# EAGLE design source_eagle (EAGLE 9.6.2)
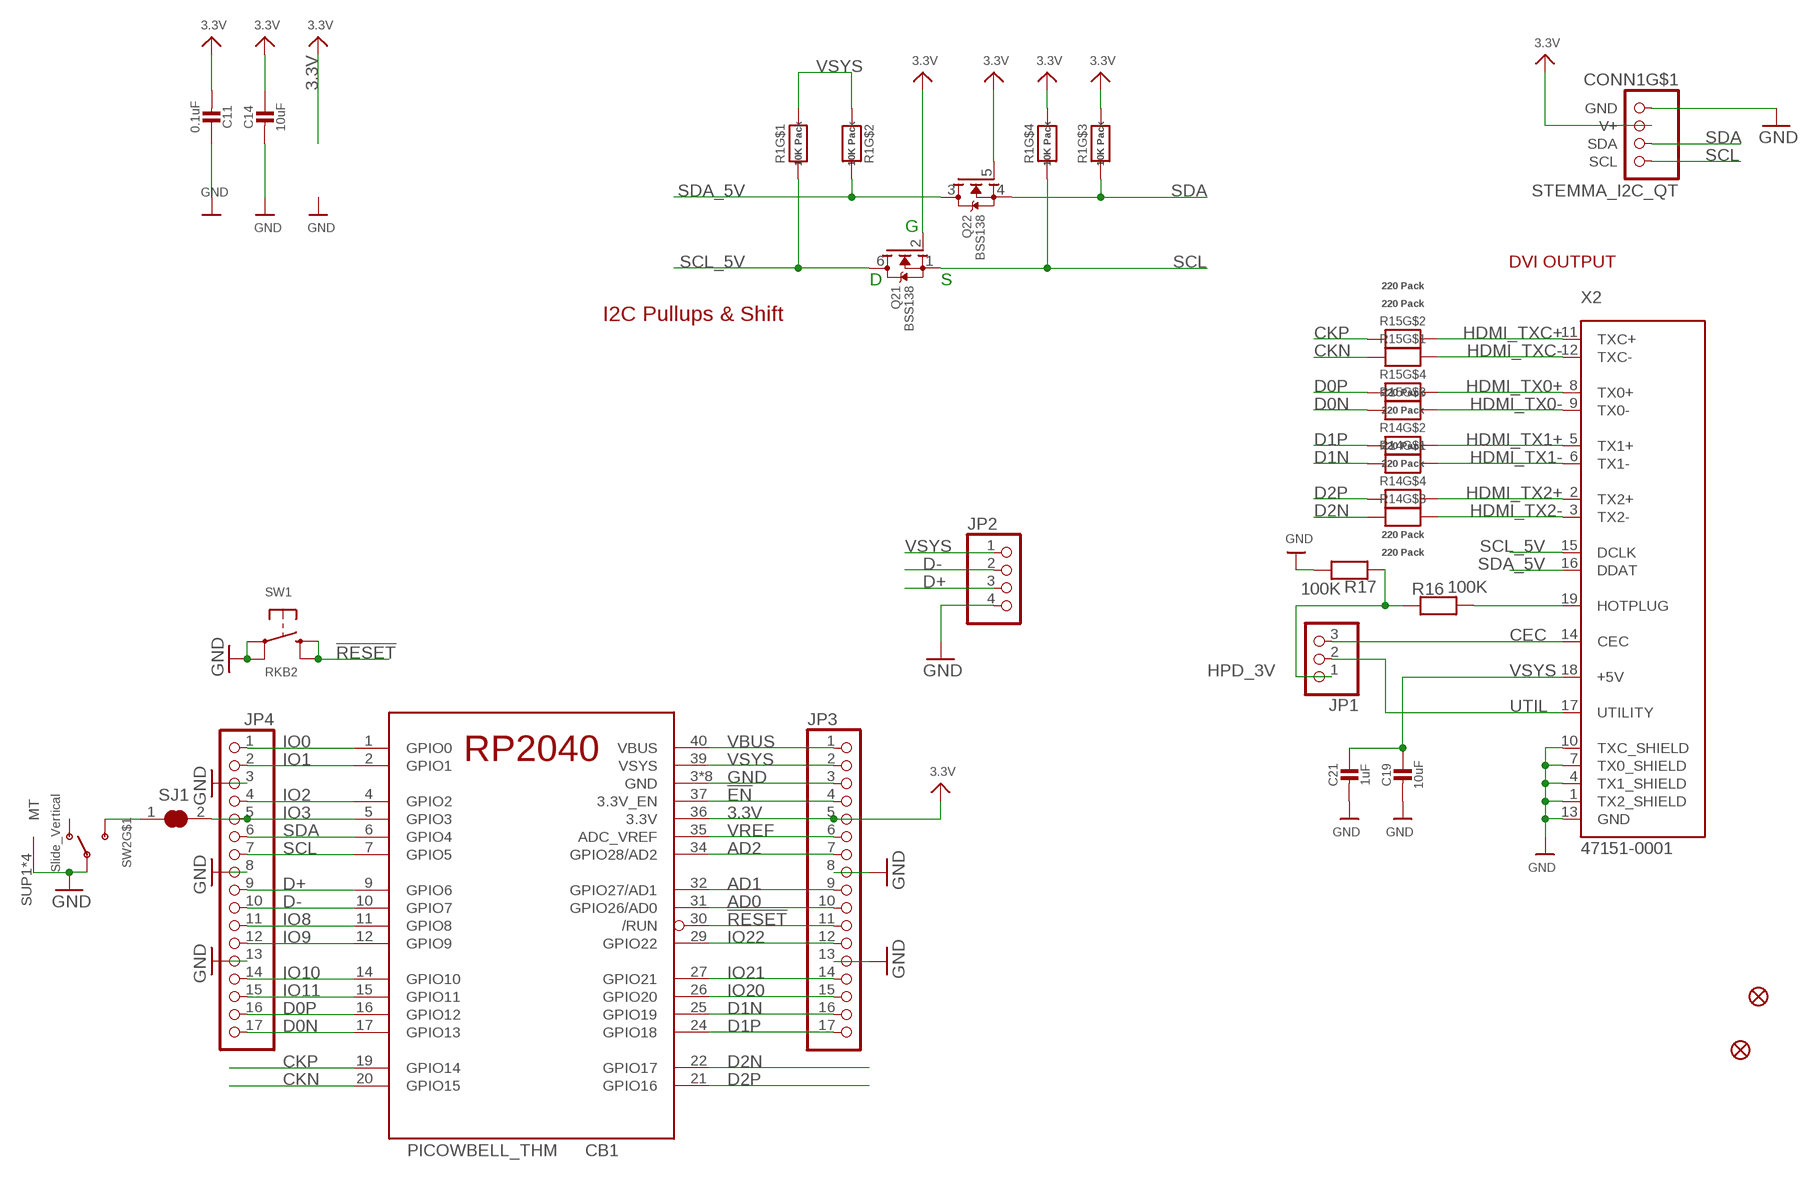
[diagram p0: schematic, sheet 1]

## Parts
C11  0.1uF  CAP_CERAMIC0603_NO  [0603-NO]
C14  10uF  CAP_CERAMIC0805-NOOUTLINE  [0805-NO]
C19  10uF  CAP_CERAMIC0805-NOOUTLINE  [0805-NO]
C21  1uF  CAP_CERAMIC0603_NO  [0603-NO]
CB1  PICOWBELL_THM  [PICOWBELL_THM]
CONN1  STEMMA_I2C_QT  [JST_SH4]
FID1  FIDUCIAL_1MM  [FIDUCIAL_1MM]
FID2  FIDUCIAL_1MM  [FIDUCIAL_1MM]
JP1  HEADER-1X3ROUND  [1X03_ROUND]
JP2  HEADER-1X4ROUND  [1X04_ROUND]
JP3  HEADER-1X17  [1X17_ROUND70]
JP4  HEADER-1X17  [1X17_ROUND70]
Q2  BSS138  MOSFET-N_DUAL  [SOT363]
R1  10K Pack  RESISTOR_4PACK  [RESPACK_4X0603]
R14  220 Pack  RESISTOR_4PACK  [RESPACK_4X0603]
R15  220 Pack  RESISTOR_4PACK  [RESPACK_4X0603]
R16  100K  RESISTOR_0603_NOOUT  [0603-NO]
R17  100K  RESISTOR_0603_NOOUT  [0603-NO]
SJ1  SOLDERJUMPER_CLOSED  [SOLDERJUMPER_CLOSEDWIRE]
SW1  RKB2  SWITCH_TACT_SMT_RKB2  [BTN_RKB2_4.6X2.8]
SW2  Slide_Vertical  SWITCH_SPDT  [SPDT_SMT_SSSS811101]
X2  47151-0001  HDMI_MOLEX_47151_MINI  [MINIHDMI_CNCTECH]

## Nets
3.3V: C11.2 C14.1 CB1.36(3.3V) CONN1.2(V+) JP3.5 Q2.2(1:G) Q2.5(2:G) R1.5 R1.6
!EN: CB1.37(3.3V_EN) JP3.4
!RESET: CB1.30(/RUN) JP3.11 SW1.B'(S1) SW1.B(S)
AD0: CB1.31(GPIO26/AD0) JP3.10
AD1: CB1.32(GPIO27/AD1) JP3.9
AD2: CB1.34(GPIO28/AD2) JP3.7
CEC: JP1.3 X2.14(CEC)
CKN: CB1.20(GPIO15) R15.8
CKP: CB1.19(GPIO14) R15.7
D0N: CB1.17(GPIO13) JP4.17 R15.6
D0P: CB1.16(GPIO12) JP4.16 R15.5
D1N: CB1.25(GPIO19) JP3.16 R14.8
D1P: CB1.24(GPIO18) JP3.17 R14.7
D2N: CB1.22(GPIO17) R14.6
D2P: CB1.21(GPIO16) R14.5
D+: CB1.9(GPIO6) JP2.3 JP4.9
D-: CB1.10(GPIO7) JP2.2 JP4.10
GND: C11.1 C14.2 C19.2 C21.2 CB1.3(GND) CB1.8(GND) CB1.13(GND) CB1.18(GND) CB1.23(GND) CB1.28(GND) CB1.33(GND) CB1.38(GND) CONN1.1(GND) JP2.4 JP3.3 JP3.8 JP3.13 JP4.3 JP4.8 JP4.13 R17.2 SW1.A'(P1) SW1.A(P) SW2.B(P) SW2.SUP1(MT) SW2.SUP2(MT) SW2.SUP3(MT) SW2.SUP4(MT) X2.1(TX2_SHIELD) X2.4(TX1_SHIELD) X2.7(TX0_SHIELD) X2.10(TXC_SHIELD) X2.13(GND)
HDMI_TX0+: R15.4 X2.8(TX0+)
HDMI_TX0-: R15.3 X2.9(TX0-)
HDMI_TX1+: R14.2 X2.5(TX1+)
HDMI_TX1-: R14.1 X2.6(TX1-)
HDMI_TX2+: R14.4 X2.2(TX2+)
HDMI_TX2-: R14.3 X2.3(TX2-)
HDMI_TXC+: R15.2 X2.11(TXC+)
HDMI_TXC-: R15.1 X2.12(TXC-)
HPD: R16.2 X2.19(HOTPLUG)
HPD_3V: JP1.1 R16.1 R17.1
IO0: CB1.1(GPIO0) JP4.1
IO1: CB1.2(GPIO1) JP4.2
IO2: CB1.4(GPIO2) JP4.4
IO3: CB1.5(GPIO3) JP4.5 SJ1.2
IO8: CB1.11(GPIO8) JP4.11
IO9: CB1.12(GPIO9) JP4.12
IO10: CB1.14(GPIO10) JP4.14
IO11: CB1.15(GPIO11) JP4.15
IO20: CB1.26(GPIO20) JP3.15
IO21: CB1.27(GPIO21) JP3.14
IO22: CB1.29(GPIO22) JP3.12
N$1: SJ1.1 SW2.C(S)
SCL: CB1.7(GPIO5) CONN1.4(SCL) JP4.7 Q2.1(1:S) R1.4
SCL_5V: Q2.6(1:D) R1.8 X2.15(DCLK)
SDA: CB1.6(GPIO4) CONN1.3(SDA) JP4.6 Q2.4(2:S) R1.3
SDA_5V: Q2.3(2:D) R1.7 X2.16(DDAT)
UTIL: JP1.2 X2.17(UTILITY)
VBUS: CB1.40(VBUS) JP3.1
VREF: CB1.35(ADC_VREF) JP3.6
VSYS: C19.1 C21.1 CB1.39(VSYS) JP2.1 JP3.2 R1.1 R1.2 X2.18(+5V)
Unconnected: CONN1.MT1(MT) CONN1.MT2(MT) SW2.A(O)

## Notes on the sheet
- G
- DVI OUTPUT
- D | S
- I2C Pullups & Shift

## Power pins joined to a net without a drawn wire
GND: X2.MNT1(GND) X2.MNT2(GND) X2.MNT3(GND) X2.MNT4(GND)

## Library data of the parts
C11 C14 C21 = microbuilder:CAP_CERAMIC: Ceramic Capacitors For new designs, use the packages preceded by an '_' character since they are more reliable: The following footprints should be used on most boards: _0402 - Standard footprint for regular board layouts _0603 - Standard footprint for regular board layouts _0805 - Standard footprint for regular board layouts _1206 - Standard footprint for regular board layouts For extremely tight-pitch boards where space is at a premium, the following 'micro-pitch' footprints can be used (smaller pads, no silkscreen outline, etc.): _0402MP - Micro-pitch footprint for very dense/compact boards _0603MP - Micro-pitch footprint for very dense/compact boards _0805MP - Micro-pitch footprint for very dense/compact boards _1206MP - Micro-pitch footprint for very dense/compact boards
C19 = microbuilder:CAP_CERAMIC: Ceramic Capacitors For new designs, use the packages preceded by an '_' character since they are more reliable: The following footprints should be used on most boards: _0402 - Standard footprint for regular board layouts _0603 - Standard footprint for regular board layouts _0805 - Standard footprint for regular board layouts _1206 - Standard footprint for regular board layouts For extremely tight-pitch boards where space is at a premium, the following 'micro-pitch' footprints can be used (smaller pads, no silkscreen outline, etc.): _0402MP - Micro-pitch footprint for very dense/compact boards _0603MP - Micro-pitch footprint for very dense/compact boards _0805MP - Micro-pitch footprint for very dense/compact boards _1206MP - Micro-pitch footprint for very dense/compact boards; REV: A
CB1 = adafruit_micro:PICOWBELL
CONN1 = adafruit_electromech:STEMMA_I2C; LCSC: C2845363
FID1 FID2 = microbuilder:FIDUCIAL: Fiducial Alignment Points Various fiducial points for machine vision alignment.; BOM: EXCLUDE
JP1 = microbuilder:HEADER-1X3: PIN HEADER
JP2 = microbuilder:HEADER-1X4: PIN HEADER
JP3 JP4 = microbuilder:HEADER-1X17: Header 1x17
Q2 = microbuilder:MOSFET-N_DUAL: Dual N-Channel MOSFET SOT363 (2.0x1.25mm) 2N7002PS - 60V, 320mA [Digikey: 568-5984-1-ND]; JLC_ROTATION: 270
R1 R14 R15 = microbuilder:RESISTOR_4PACK: Resistor Packs (4 resistors) 4 x 0603 10K 1/16W - Digikey: YC164J-10KCT-ND
R16 R17 = microbuilder:RESISTOR: Resistors For new designs, use the packages preceded by an '_' character since they are more reliable: The following footprints should be used on most boards: _0402 - Standard footprint for regular board layouts _0603 - Standard footprint for regular board layouts _0805 - Standard footprint for regular board layouts _1206 - Standard footprint for regular board layouts For extremely tight-pitch boards where space is at a premium, the following 'micro-pitch' footprints can be used (smaller pads, no silkscreen outline, etc.): _0402MP - Micro-pitch footprint for very dense/compact boards _0603MP - Micro-pitch footprint for very dense/compact boards _0805MP - Micro-pitch footprint for very dense/compact boards _1206MP - Micro-pitch footprint for very dense/compact boards
SJ1 = microbuilder:SOLDERJUMPER_CLOSED: Solder Jumper - Closed These solder jumpers are closed by default CLOSEDWIRE - 10 mil trace between pads that can be cut and resoldered later CLOSEDPERM - 63 mil trace between pads for a permanent connection (used to 'bridge' two signals, a shameless hack for Eagle). Can double as a test point as well (no cream layer)
SW1 = adafruit_electromech:SWITCH_TACT_SMT: SMT Tact Switches RKB2 https://www.digikey.com/short/m027prz5
SW2 = adafruit_electromech:SWITCH_SPDT: Switch - SPDT SSSS811101 - Horizontal Two Position SMT, 0.3A 4V [Mouser: 688-SSSS811101]
X2 = adafruit_electromech:HDMI_MOLEX_47151: The default footprint uses layer 46 (Milling) for the tabs, the DIMLAYER footprint uses layer 20 (Dimensions). Both will probably require special instructions to the board house

## Net classes
1 highpower: width 0.305 mm, drill 0.381 mm

## Board
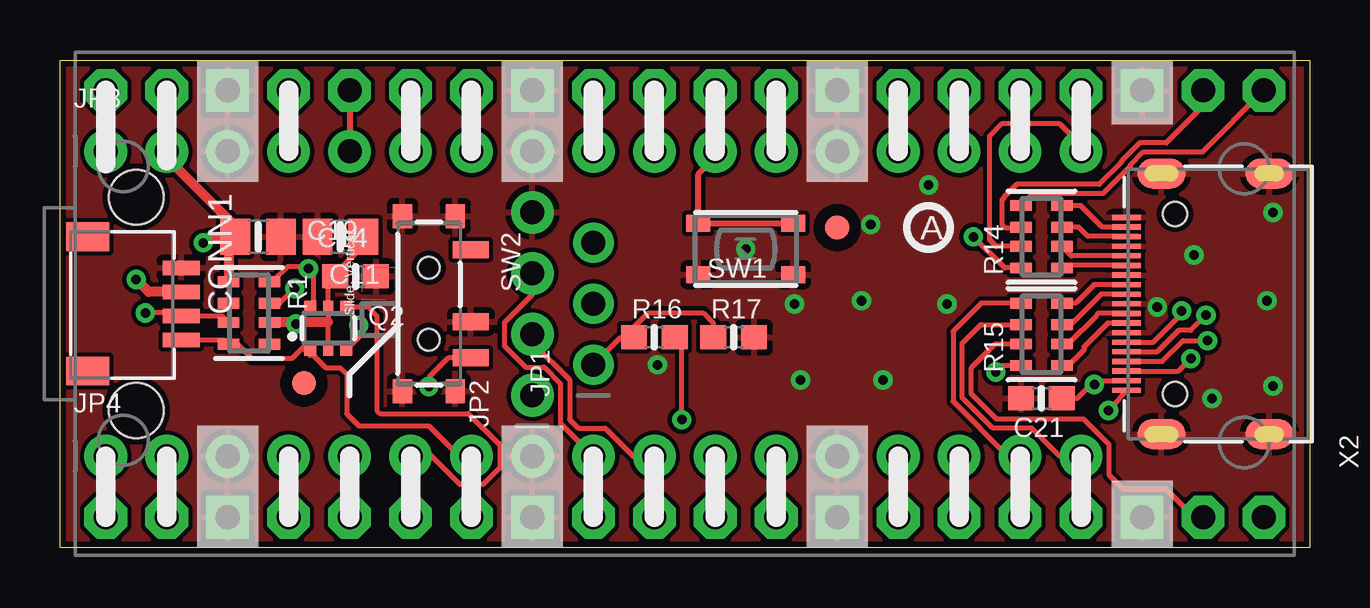
[diagram p1: board, top side]
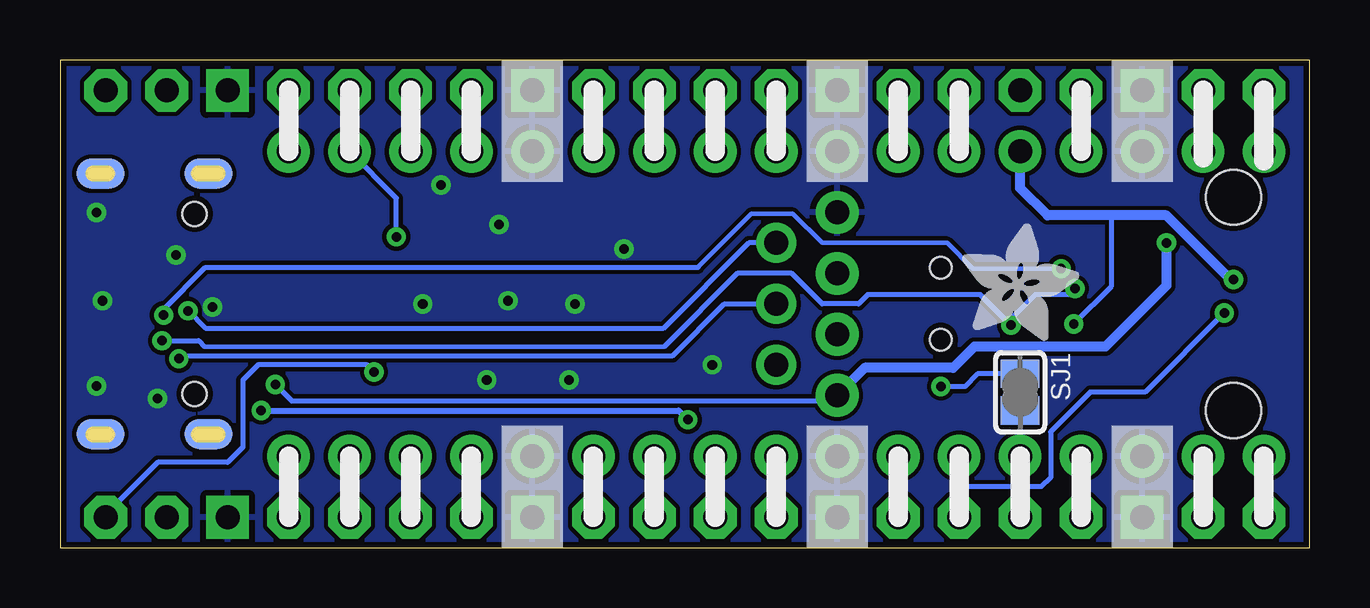
[diagram p2: board, bottom side, seen from below]

Size 52.07 x 20.32 mm. Coordinates in mm from the lower left corner, seen from the top.
Outline: 0,0 0,20.32 52.07,20.32 52.07,0 0,0
Copper layers (1*16): Top 0.035mm / dielectric 1.5mm / Bottom 0.035mm
Design rules "adafruit 7-7": minimum track width 7mil, minimum drill 15.5mil, track to track 7mil, track to pad 7mil, pad to pad 7mil, via to via 7mil, smd to smd 7mil, copper to edge 10mil, drill to drill 8mil, minimum pad ring 7mil, minimum via ring 8mil, stop-mask expansion 2mil, vias tented up to drill 20mil, thermal gap 10mil
Holes 2.29 mm at 3.17,14.61 3.17,5.71

### Footprints (pad centres in the part's own frame; a part is rotated, then mirrored left to right if it is on the bottom)
0603-NO = smd 1.075 x 1: 1 -0.85,0; 2 0.85,0
0805-NO = smd 1.24 x 1.5: 1 -0.95,0; 2 0.95,0
PICOWBELL_THM = drill 1 pad 1.778 octagon: 1 -24.13,-8.89; 2 -21.59,-8.89; 4 -16.51,-8.89; 5 -13.97,-8.89; 6 -11.43,-8.89; 7 -8.89,-8.89; 9 -3.81,-8.89; 10 -1.27,-8.89; 11 1.27,-8.89; 12 3.81,-8.89; 14 8.89,-8.89; 15 11.43,-8.89; 16 13.97,-8.89; 17 16.51,-8.89; 19 21.59,-8.89; 20 24.13,-8.89; 21 24.13,8.89; 22 21.59,8.89; 24 16.51,8.89; 25 13.97,8.89; 26 11.43,8.89; 27 8.89,8.89; 29 3.81,8.89; 30 1.27,8.89; 31 -1.27,8.89; 32 -3.81,8.89; 34 -8.89,8.89; 35 -11.43,8.89; 36 -13.97,8.89; 37 -16.51,8.89; 39 -21.59,8.89; 40 -24.13,8.89 | drill 1 pad 1.778 square: 3 -19.05,-8.89; 8 -6.35,-8.89; 13 6.35,-8.89; 18 19.05,-8.89; 23 19.05,8.89; 28 6.35,8.89; 33 -6.35,8.89; 38 -19.05,8.89
JST_SH4 = smd 0.6 x 1.55: 1 -1.5,2.006; 2 -0.5,2.006; 3 0.5,2.006; 4 1.5,2.006 | smd 1.2 x 1.8: MT1 -2.8,-1.894; MT2 2.8,-1.894
FIDUCIAL_1MM = smd 1 x 1: 1 0,0
1X03_ROUND = drill 1 pad 1.676: 1 -2.54,0; 2 0,0; 3 2.54,0
1X04_ROUND = drill 1 pad 1.778: 1 -3.81,0; 2 -1.27,0; 3 1.27,0; 4 3.81,0
1X17_ROUND70 = drill 1 pad 1.778: 1 -20.32,0; 2 -17.78,0; 3 -15.24,0; 4 -12.7,0; 5 -10.16,0; 6 -7.62,0; 7 -5.08,0; 8 -2.54,0; 9 0,0; 10 2.54,0; 11 5.08,0; 12 7.62,0; 13 10.16,0; 14 12.7,0; 15 15.24,0; 16 17.78,0; 17 20.32,0
SOT363 = smd 0.5 x 0.5: 1 -0.75,-0.9; 3 0.75,-0.9; 4 0.75,0.9; 6 -0.75,0.9 | smd 0.4 x 0.5: 2 0,-0.9; 5 0,0.9
RESPACK_4X0603 = smd 0.45 x 0.9: 1 -1.3,-0.85; 2 -0.4,-0.85; 3 0.4,-0.85; 4 1.3,-0.85; 5 1.3,0.85; 6 0.4,0.85; 7 -0.4,0.85; 8 -1.3,0.85
SOLDERJUMPER_CLOSEDWIRE = smd 1.168 x 1.6: 1 -0.762,0; 2 0.762,0 | smd 0.635 x 0.203: WIRE 0,0
BTN_RKB2_4.6X2.8 = smd 1 x 0.7: A 1.973,1.075; A' -1.973,1.075; B 1.973,-1.075; B' -1.973,-1.075
SPDT_SMT_SSSS811101 = smd 0.7 x 1.5: A -2.25,1.242; B 0.75,1.242; C 2.25,1.242 | smd 1 x 0.8: SUP1 -3.65,0.592; SUP2 -3.65,-1.608; SUP3 3.65,0.592; SUP4 3.65,-1.608 | hole 0.9: -1.5,-0.508; 1.5,-0.508
MINIHDMI_CNCTECH = smd 0.22 x 1.194: 1 3.6,3.066; 2 3.2,3.066; 3 2.8,3.066; 4 2.4,3.066; 5 2,3.066; 6 1.6,3.066; 7 1.2,3.066; 8 0.8,3.066; 9 0.4,3.066; 10 0,3.066; 11 -0.4,3.066; 12 -0.8,3.066; 13 -1.2,3.066; 14 -1.6,3.066; 15 -2,3.066; 16 -2.4,3.066; 17 -2.8,3.066; 18 -3.2,3.066; 19 -3.6,3.066 | smd 1.25 x 2: MNT1 5.425,1.606; MNT2 5.425,-2.894; MNT3 -5.425,-2.894; MNT4 -5.425,1.606 | smd 1.25 x 2 bottom: MNT5 5.425,1.606; MNT6 5.425,-2.894; MNT7 -5.425,-2.894; MNT8 -5.425,1.606 | hole 1: -3.75,1.038; 3.75,1.038

### Placement (x,y rotation side)
C11  12.32,11.3 180 top
C14  11.68,12.95 180 top
C19  8.26,12.95 0 top
C21  40.89,6.22 180 top
CB1  26.04,10.16 0 top
CONN1  3.05,10.16 270 top
FID1  10.16,6.86 0 top
FID2  32.38,13.33 0 top
JP1  22.23,10.16 90 top
JP2  19.68,10.16 90 top
JP3  22.23,16.51 0 top
JP4  22.23,3.81 0 top
PLABEL109  [PLABEL109]  4.7,10.1 90 bottom
PLABEL110  [PLABEL110]  6.73,6.98 0 top
PLABEL111  [PLABEL111]  23.37,7.24 0 top
PLABEL112  [PLABEL112]  23.5,10.16 0 top
PLABEL113  [PLABEL113]  23.5,12.57 0 top
PLABEL114  [PLABEL114]  1.14,14.61 90 top
PLABEL115  [PLABEL115]  5.08,14.61 90 top
PLABEL116  [PLABEL116]  12.06,14.99 0 top
PLABEL117  [PLABEL117]  27.3,14.99 0 top
PLABEL118  [PLABEL118]  50.16,17.4 0 top
PLABEL119  [PLABEL119]  47.62,17.4 0 top
PLABEL120  [PLABEL120]  29.84,14.99 0 top
PLABEL121  [PLABEL121]  37.47,14.99 0 top
PLABEL122  [PLABEL122]  44.45,16.51 0 top
PLABEL123  [PLABEL123]  37.21,5.33 0 top
PLABEL124  [PLABEL124]  34.92,14.99 0 top
PLABEL125  [PLABEL125]  39.62,5.33 0 top
PLABEL126  [PLABEL126]  24.77,14.99 0 top
PLABEL127  [PLABEL127]  17.14,14.99 0 top
PLABEL128  [PLABEL128]  14.61,14.99 0 top
PLABEL129  [PLABEL129]  17.14,5.46 0 top
PLABEL130  [PLABEL130]  14.22,5.46 0 top
PLABEL131  [PLABEL131]  12.06,5.46 0 top
PLABEL132  [PLABEL132]  9.53,5.46 0 top
PLABEL133  [PLABEL133]  4.95,5.46 0 top
PLABEL134  [PLABEL134]  1.4,5.46 0 top
PLABEL135  [PLABEL135]  43.18,5.33 0 top
PLABEL136  [PLABEL136]  47.62,2.92 0 top
PLABEL137  [PLABEL137]  50.16,2.92 0 top
PLABEL138  [PLABEL138]  22.23,5.33 0 top
PLABEL139  [PLABEL139]  9.53,14.99 0 top
PLABEL140  [PLABEL140]  22.23,14.99 0 top
PLABEL141  [PLABEL141]  34.92,5.33 0 top
PLABEL142  [PLABEL142]  29.84,5.33 0 top
PLABEL143  [PLABEL143]  27.3,5.33 0 top
PLABEL144  [PLABEL144]  24.77,5.33 0 top
PLABEL145  [PLABEL145]  31.11,6.48 0 top
PLABEL146  [PLABEL146]  28.32,10.16 0 top
PLABEL147  [PLABEL147]  17.27,13.72 0 top
PLABEL148  [PLABEL148]  17.65,9.91 90 top
PLABEL149  [PLABEL149]  21.21,9.27 270 top
PLABEL150  [PLABEL150]  17.02,6.86 0 top
PLABEL151  [PLABEL151]  41.4,15.49 0 top
PLABEL152  [PLABEL152]  8.76,7.37 0 bottom
PLABEL154  [PLABEL154]  44.7,10.03 0 bottom
PLABEL155  [PLABEL155]  50.16,2.92 0 bottom
PLABEL156  [PLABEL156]  47.62,2.92 0 bottom
PLABEL157  [PLABEL157]  45.09,2.92 0 bottom
PLABEL158  [PLABEL158]  42.55,5.46 0 bottom
PLABEL159  [PLABEL159]  40.01,5.46 0 bottom
PLABEL160  [PLABEL160]  37.47,5.46 0 bottom
PLABEL161  [PLABEL161]  34.92,5.46 0 bottom
PLABEL162  [PLABEL162]  29.84,5.46 0 bottom
PLABEL163  [PLABEL163]  27.3,5.46 0 bottom
PLABEL164  [PLABEL164]  24.77,5.46 0 bottom
PLABEL165  [PLABEL165]  22.23,5.46 0 bottom
PLABEL166  [PLABEL166]  17.14,5.46 0 bottom
PLABEL167  [PLABEL167]  14.61,5.46 0 bottom
PLABEL168  [PLABEL168]  9.53,5.46 0 bottom
PLABEL169  [PLABEL169]  4.95,5.46 0 bottom
PLABEL170  [PLABEL170]  1.14,5.46 0 bottom
PLABEL171  [PLABEL171]  16.89,13.21 0 bottom
PLABEL172  [PLABEL172]  17.4,11.3 0 bottom
PLABEL173  [PLABEL173]  17.65,9.02 0 bottom
PLABEL174  [PLABEL174]  17.65,6.98 0 bottom
PLABEL175  [PLABEL175]  9.53,14.86 0 bottom
PLABEL176  [PLABEL176]  12.06,14.86 0 bottom
PLABEL177  [PLABEL177]  14.61,14.86 0 bottom
PLABEL178  [PLABEL178]  17.14,14.86 0 bottom
PLABEL179  [PLABEL179]  22.23,14.86 0 bottom
PLABEL180  [PLABEL180]  24.77,14.86 0 bottom
PLABEL181  [PLABEL181]  27.3,14.86 0 bottom
PLABEL182  [PLABEL182]  29.84,14.86 0 bottom
PLABEL183  [PLABEL183]  42.55,14.86 0 bottom
PLABEL184  [PLABEL184]  40.01,14.86 0 bottom
PLABEL185  [PLABEL185]  45.09,17.4 0 bottom
PLABEL186  [PLABEL186]  47.62,17.4 0 bottom
PLABEL187  [PLABEL187]  50.16,17.4 0 bottom
PLABEL188  [PLABEL188]  37.47,14.86 0 bottom
PLABEL189  [PLABEL189]  34.92,14.86 0 bottom
PLABEL190  [PLABEL190]  4.95,14.61 90 bottom
PLABEL191  [PLABEL191]  0.89,14.86 90 bottom
PLABEL192  [PLABEL192]  48.9,10.16 90 bottom
PLABEL193  [PLABEL193]  31.5,9.02 0 bottom
Q2  11.18,9.14 0 top
R1  7.87,9.78 270 top
R14  40.89,12.95 90 top
R15  40.89,8.89 90 top
R16  24.77,8.76 0 top
R17  28.07,8.76 0 top
SJ1  12.06,6.48 270 bottom
SW1  28.57,12.45 180 top
SW2  15.88,10.16 270 top
U$1  [ADAFRUIT_5MM]  14.48,8.64 0 bottom
U$10  [PCBFEAT-REV-040]  36.2,13.33 0 top
X2  47.5,10.16 90 top

### Tracks (layer width: path | path; a pad name or v marks a point on that pad's centre or on a via)
3.3V  (via drill 0.39)
  Top 0.203: C14.1 12.63,12.57 11.36,11.3 | R1.6 R1.5 | C11.2 11.36,11.3 | 11.36,11.3 11.18,11.12 Q2.5 11.18,9.4 Q2.2 | 10.16,9.4 10.08,9.32 v9.83,9.32
  Top 0.254: CB1.36 JP3.5
  Top 0.406: CONN1.2 3.69,10.66 v3.17,11.18 | 11.18,9.4 10.16,9.4 8.74,9.4 R1.6
  Bottom 0.203: v9.83,9.32 8.26,10.9 8.26,13.84
  Bottom 0.406: v3.17,11.18 3.3,11.18 5.97,13.84 8.26,13.84 10.92,13.84 12.06,14.99 JP3.5
!EN
  Bottom 0.406: CB1.37 JP3.4
!RESET
  Top 0.254: SW1.B' SW1.B 26.6,15.55 27.3,16.26 JP3.11
  Bottom 0.406: JP3.11 CB1.30
AD0
  Bottom 0.406: CB1.31 JP3.10
AD1
  Bottom 0.406: CB1.32 JP3.9
AD2
  Bottom 0.406: CB1.34 JP3.7
CEC  (via drill 0.39)
  Top 0.203: v46.74,9.87 46.74,9.74 45.55,8.56 X2.14
  Bottom 0.203: v46.74,9.87 46.01,9.14 26.92,9.14 23.37,12.7 JP1.3
CKN  (via drill 0.39)
  Top 0.203: R15.8 39.26,7.59 v38.99,7.32
  Bottom 0.203: v38.99,7.32 39.29,7.62 43.81,7.62 44.45,6.98 44.45,4.19 45.09,3.56 48.01,3.56 50.24,1.33 CB1.20
CKP
  Top 0.203: CB1.19 47.46,1.06 46.09,2.44 44.3,2.44 43.71,3.02 43.71,4.29 42.65,5.36 39.02,5.36 37.97,6.41 37.97,7.49 38.97,8.49 R15.7
D0N
  Top 0.203: JP4.17 41.66,3.81 40.49,4.98 38.87,4.98 37.59,6.25 37.59,8.51 38.37,9.29 R15.6
  Bottom 0.406: JP4.17 CB1.17
D0P
  Top 0.203: R15.5 38.38,10.19 37.21,9.02 37.21,6.1 39.5,3.81 JP4.16
  Bottom 0.406: CB1.16 JP4.16
D1N  (via drill 0.39)
  Top 0.203: R14.8 39.36,11.65 v38.06,12.95
  Bottom 0.203: v38.06,12.95 38.06,14.56 JP3.16
  Bottom 0.406: JP3.16 CB1.25
D1P
  Top 0.203: R14.7 39.01,12.55 38.73,12.83 38.73,17.14 39.27,17.68 41.63,17.68 42.55,16.76 JP3.17
  Bottom 0.406: CB1.24 JP3.17
D2N
  Top 0.203: CB1.22 47.62,18.52 47.68,18.45 46.1,16.87 44.98,16.87 44.23,16.12 44.23,16.07 43.3,15.14 39.86,15.14 39.31,14.59 39.31,14.55 39.24,14.48 39.24,13.46 39.37,13.33 40.02,13.33 R14.6
D2P
  Top 0.203: R14.5 40.55,14.76 43.46,14.76 44.61,15.91 44.61,15.96 45.14,16.49 47.6,16.49 CB1.21
D+
  Top 0.203: JP2.3 19.68,10.54 18.52,9.37 18.52,8.41 19.4,7.52 20.17,7.52 20.85,6.83 20.85,5.18 JP4.9
  Bottom 0.406: CB1.9 JP4.9
D-
  Top 0.203: JP2.2 19.68,8.54 21.23,6.99 21.23,5.34 21.59,4.98 22.71,4.98 23.88,3.81 JP4.10
  Bottom 0.406: JP4.10 CB1.10
GND  (via drill 0.4)
  other vias: 47.24,12.19 48.01,6.22 50.55,6.73 50.55,13.97 50.29,10.29 36.2,15.11 33.78,13.46 28.57,12.45 30.61,10.16 30.86,6.98 34.29,6.98 24.89,7.62 33.4,10.29 36.96,10.16 45.72,10.03
  pour Top: 0,20.32 52.07,20.32 52.07,0 0,0
  pour Bottom: 0,20.32 52.07,20.32 52.07,0 0,0
HDMI_TX0+
  Top 0.203: X2.8 43.09,10.96 42.32,10.19 R15.4
HDMI_TX0-
  Top 0.203: X2.9 43.38,10.56 42.11,9.29 R15.3
HDMI_TX1+
  Top 0.203: R14.2 42.14,12.16 X2.5
HDMI_TX1-
  Top 0.203: X2.6 41.85,11.76 R14.1
HDMI_TX2+
  Top 0.203: X2.2 43.44,13.36 42.54,14.25 R14.4
HDMI_TX2-
  Top 0.203: X2.3 44.93,12.97 42.83,12.97 42.45,13.35 R14.3
HDMI_TXC+
  Top 0.203: X2.11 43.23,9.76 43.18,9.65 42.01,8.49 R15.2
HDMI_TXC-
  Top 0.203: X2.12 43.65,9.36 42.67,8.38 42.67,8.26 42.01,7.59 R15.1
HPD  (via drill 0.39)
  Top 0.203: X2.19 43.82,5.85 v43.69,5.71 | v25.91,5.33 25.91,9.06 R16.2
  Bottom 0.254: v43.69,5.71 26.29,5.71 v25.91,5.33
HPD_3V
  Top 0.203: JP1.1 23.37,8.76 R16.1 23.91,9.18 24.51,9.78 26.8,9.78 27.22,9.36 R17.1
IO0
  Bottom 0.406: JP4.1 CB1.1
IO1
  Bottom 0.406: CB1.2 JP4.2
IO2
  Bottom 0.406: JP4.4 CB1.4
IO3
  Top 0.305: JP4.5 CB1.5
  Bottom 0.203: SJ1.2 JP4.5
IO8
  Bottom 0.406: CB1.11 JP4.11
IO9
  Bottom 0.406: JP4.12 CB1.12
IO10
  Bottom 0.406: CB1.14 JP4.14
IO11
  Bottom 0.406: JP4.15 CB1.15
IO20
  Bottom 0.406: CB1.26 JP3.15
IO21
  Bottom 0.406: JP3.14 CB1.27
IO22
  Bottom 0.406: CB1.29 JP3.12
N$1  (via drill 0.39)
  Top 0.203: SW2.C 16.18,7.91 15.37,7.09 v15.37,6.71
  Bottom 0.203: SJ1.1 13.84,7.24 14.37,6.71 v15.37,6.71
SCL
  Top 0.203: CONN1.4 6.84,8.66 R1.4 7.4,8.48 8,7.87 9.65,7.87 10.11,8.33 10.43,8.01 10.43,8.14 | Q2.1 10.43,8.14 | 10.43,8.14 11.07,7.49 11.68,7.49 11.94,7.24 11.94,5.59 12.45,5.08 15.37,5.08 16.64,3.81 JP4.7
  Bottom 0.406: JP4.7 CB1.7
SCL_5V  (via drill 0.39)
  Top 0.203: R1.8 8.85,11.08 9.49,11.71 10.28,11.71 v10.35,11.64 | Q2.6 10.55,10.17 10.55,11.44 v10.35,11.64 | X2.15 45.71,8.16 46.61,9.05 47.12,9.05 v47.75,9.69 | v10.35,11.63 v10.35,11.64
  Bottom 0.178: 25.5,11.68 23.27,13.91 21.53,13.91 20.32,12.7 15.11,12.7 14.04,11.63 v10.35,11.63
  Bottom 0.203: v47.75,9.69 47.75,9.94 46.01,11.68 25.5,11.68
SDA  (via drill 0.39)
  Top 0.203: R1.3 6.74,9.66 CONN1.3 4.93,9.78 v3.56,9.78 | Q2.4 12.82,10.04 13.21,9.65 13.21,5.71 13.34,5.59 17.02,5.59 18.31,4.29 18.31,3.33 17.63,2.64 16.66,2.64 15.49,3.81 JP4.6
  Bottom 0.203: v3.56,9.78 6.86,6.48 9.14,6.48 10.79,4.83 10.79,2.92 11.18,2.54 14.22,2.54 14.61,2.92 JP4.6
  Bottom 0.406: CB1.6 JP4.6
SDA_5V  (via drill 0.39)
  Top 0.203: R1.7 9.16,10.18 v9.78,10.79 | v12.45,9.27 12.57,9.14 12.57,8.89 Q2.3 | X2.16 45.94,7.76 46.8,8.62 v47.82,8.62
  Bottom 0.178: 46.05,8.38 26.89,8.38
  Bottom 0.203: v47.82,8.62 46.29,8.62 46.05,8.38 | 26.89,8.38 23.84,11.43 21.59,11.43 20.32,10.16 18.8,10.16 18.41,10.54 13.72,10.54 v12.45,9.27 12.45,9.53 11.43,10.54 10.03,10.54 v9.78,10.79
UTIL  (via drill 0.39)
  Top 0.203: v47.12,7.87 46.6,7.36 X2.17
  Bottom 0.203: JP1.2 24.38,10.16 26.54,8 46.99,8 v47.12,7.87
VBUS
  Bottom 0.406: JP3.1 CB1.40
VREF
  Bottom 0.406: CB1.35 JP3.6
VSYS  (via drill 0.39)
  Top 0.203: R1.1 R1.2 | C21.1 42.38,6.22 43.12,6.96 43.26,6.96 | 43.26,6.96 X2.18 | 43.26,6.96 v43.1,6.8
  Top 0.406: C19.1 7.02,12.67 R1.1 | JP3.2 4.45,16.26 7.3,13.4 C19.1 | C19.1 6.22,12.95 v5.97,12.7
  Bottom 0.203: v43.1,6.8 42.42,6.12 19.91,6.12 JP2.1
  Bottom 0.406: CB1.39 JP3.2 | v5.97,12.7 5.97,10.92 8.51,8.38 13.97,8.38 14.86,7.49 18.54,7.49 JP2.1

### Text on the board
Pinguin_tBackup: 2- | 2+ | 1+ | EN | 3V | Vr | A2 | A1 | A0 | R | 22 | 21 | 20 | 1- | VB | VS | G | CEC | D+ | Util | Reset | D- | I2C | 5V | HotPlug | Adafruit / HSTX Out / PiCowBell | 0 | 1 | 2 | 3 | SDA | SCL | D+ | D- | 8 | 9 | 10 | 11 | 0+ | 0- | C+ | C-
Pinguin_bBackup: G | 17 | 16 | VB | EN | 3V | VR | A2 | A1 | A0 | 23 | 22 | 21 | 20 | 19 | 18 | VS | GND | D+ | Adafruit HSTX / DVI Output / PiCowbell | Mini HDMI / Connector | D- | HSTX Pins / 12~19 / USB: 6+7 | Switch | 5V | 0 | 1 | 2 | 4 | 5 | 6 | 7 | 8 | 9 | 10 | 11 | 12 | 13 | G | 14 | 15